# EAGLE design multi_fly (EAGLE 5.11)

## Sheet 1 of 3
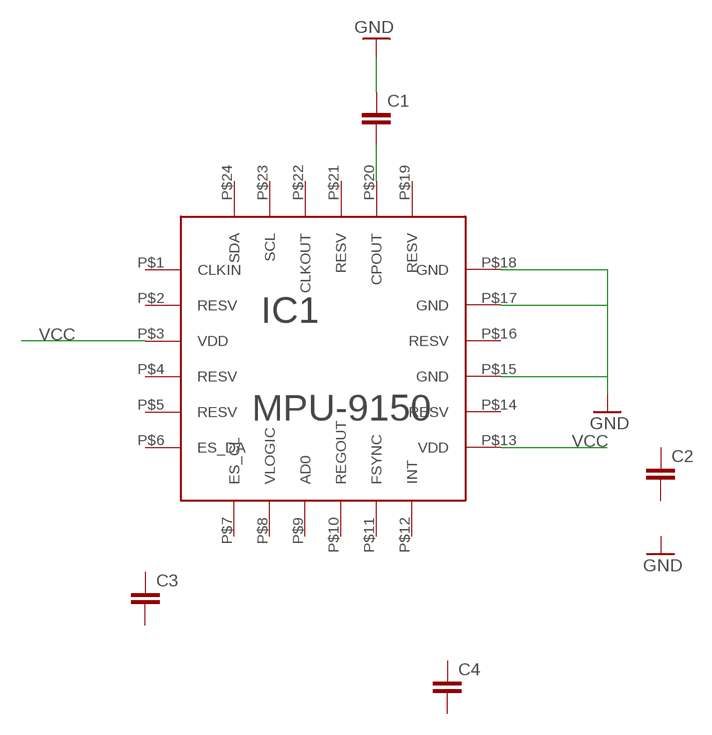
[diagram p0: schematic, sheet 1]

### Parts
C1  CAP0603-CAP  [0603-CAP]
C2  CAP0603-CAP  [0603-CAP]
C3  CAP0603-CAP  [0603-CAP]
C4  CAP0603-CAP  [0603-CAP]
IC1  MPU-9150  [MPU-9150]

### Nets
GND: C1.1 IC1.P$15(GND) IC1.P$17(GND) IC1.P$18(GND) ; also sheet 2,3
N$1: C1.2 IC1.P$20(CPOUT)
VCC: IC1.P$3(VDD) IC1.P$13(VDD) ; also sheet 2,3
Unconnected: C2.1 C2.2 C3.1 C3.2 C4.1 C4.2 IC1.P$1(CLKIN) IC1.P$2(RESV) IC1.P$4(RESV) IC1.P$5(RESV) IC1.P$6(ES_DA) IC1.P$7(ES_CL) IC1.P$8(VLOGIC) IC1.P$9(AD0) IC1.P$10(REGOUT) IC1.P$11(FSYNC) IC1.P$12(INT) IC1.P$14(RESV) IC1.P$16(RESV) IC1.P$19(RESV) IC1.P$21(RESV) IC1.P$22(CLKOUT) IC1.P$23(SCL) IC1.P$24(SDA)

## Sheet 2 of 3
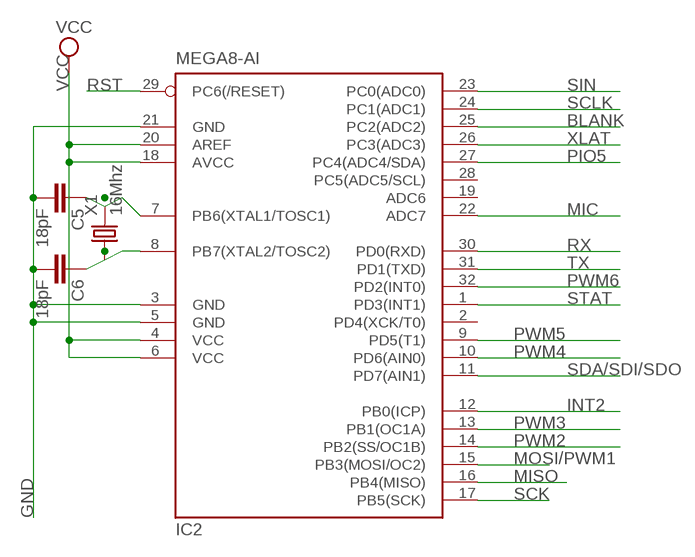
[diagram p1: schematic, sheet 2]

### Parts
C5  18pF  CAP0603-CAP  [0603-CAP]
C6  18pF  CAP0603-CAP  [0603-CAP]
IC2  MEGA8-AI  [TQFP32-08]
X1  16Mhz  CRYSTAL-5032  [5032]

### Nets
BLANK: IC2.25(PC2(ADC2))
GND: C5.2 C6.2 IC2.3(GND) IC2.5(GND) IC2.21(GND) ; also sheet 1,3
INT2: IC2.12(PB0(ICP))
MIC: IC2.22(ADC7)
MISO: IC2.16(PB4(MISO))
MOSI/PWM1: IC2.15(PB3(MOSI/OC2)) ; also sheet 3
N$7: C5.1 IC2.7(PB6(XTAL1/TOSC1)) X1.2
N$8: C6.1 IC2.8(PB7(XTAL2/TOSC2)) X1.1
PIO5: IC2.27(PC4(ADC4/SDA))
PWM2: IC2.14(PB2(SS/OC1B)) ; also sheet 3
PWM3: IC2.13(PB1(OC1A)) ; also sheet 3
PWM4: IC2.10(PD6(AIN0)) ; also sheet 3
PWM5: IC2.9(PD5(T1)) ; also sheet 3
PWM6: IC2.32(PD2(INT0)) ; also sheet 3
RST: IC2.29(PC6(/RESET))
RX: IC2.30(PD0(RXD))
SCK: IC2.17(PB5(SCK))
SCLK: IC2.24(PC1(ADC1))
SDA/SDI/SDO: IC2.11(PD7(AIN1))
SIN: IC2.23(PC0(ADC0))
STAT: IC2.1(PD3(INT1))
TX: IC2.31(PD1(TXD))
VCC: IC2.4(VCC) IC2.6(VCC) IC2.18(AVCC) IC2.20(AREF) ; also sheet 1,3
XLAT: IC2.26(PC3(ADC3))
Unconnected: IC2.2(PD4(XCK/T0)) IC2.19(ADC6) IC2.28(PC5(ADC5/SCL))

## Sheet 3 of 3
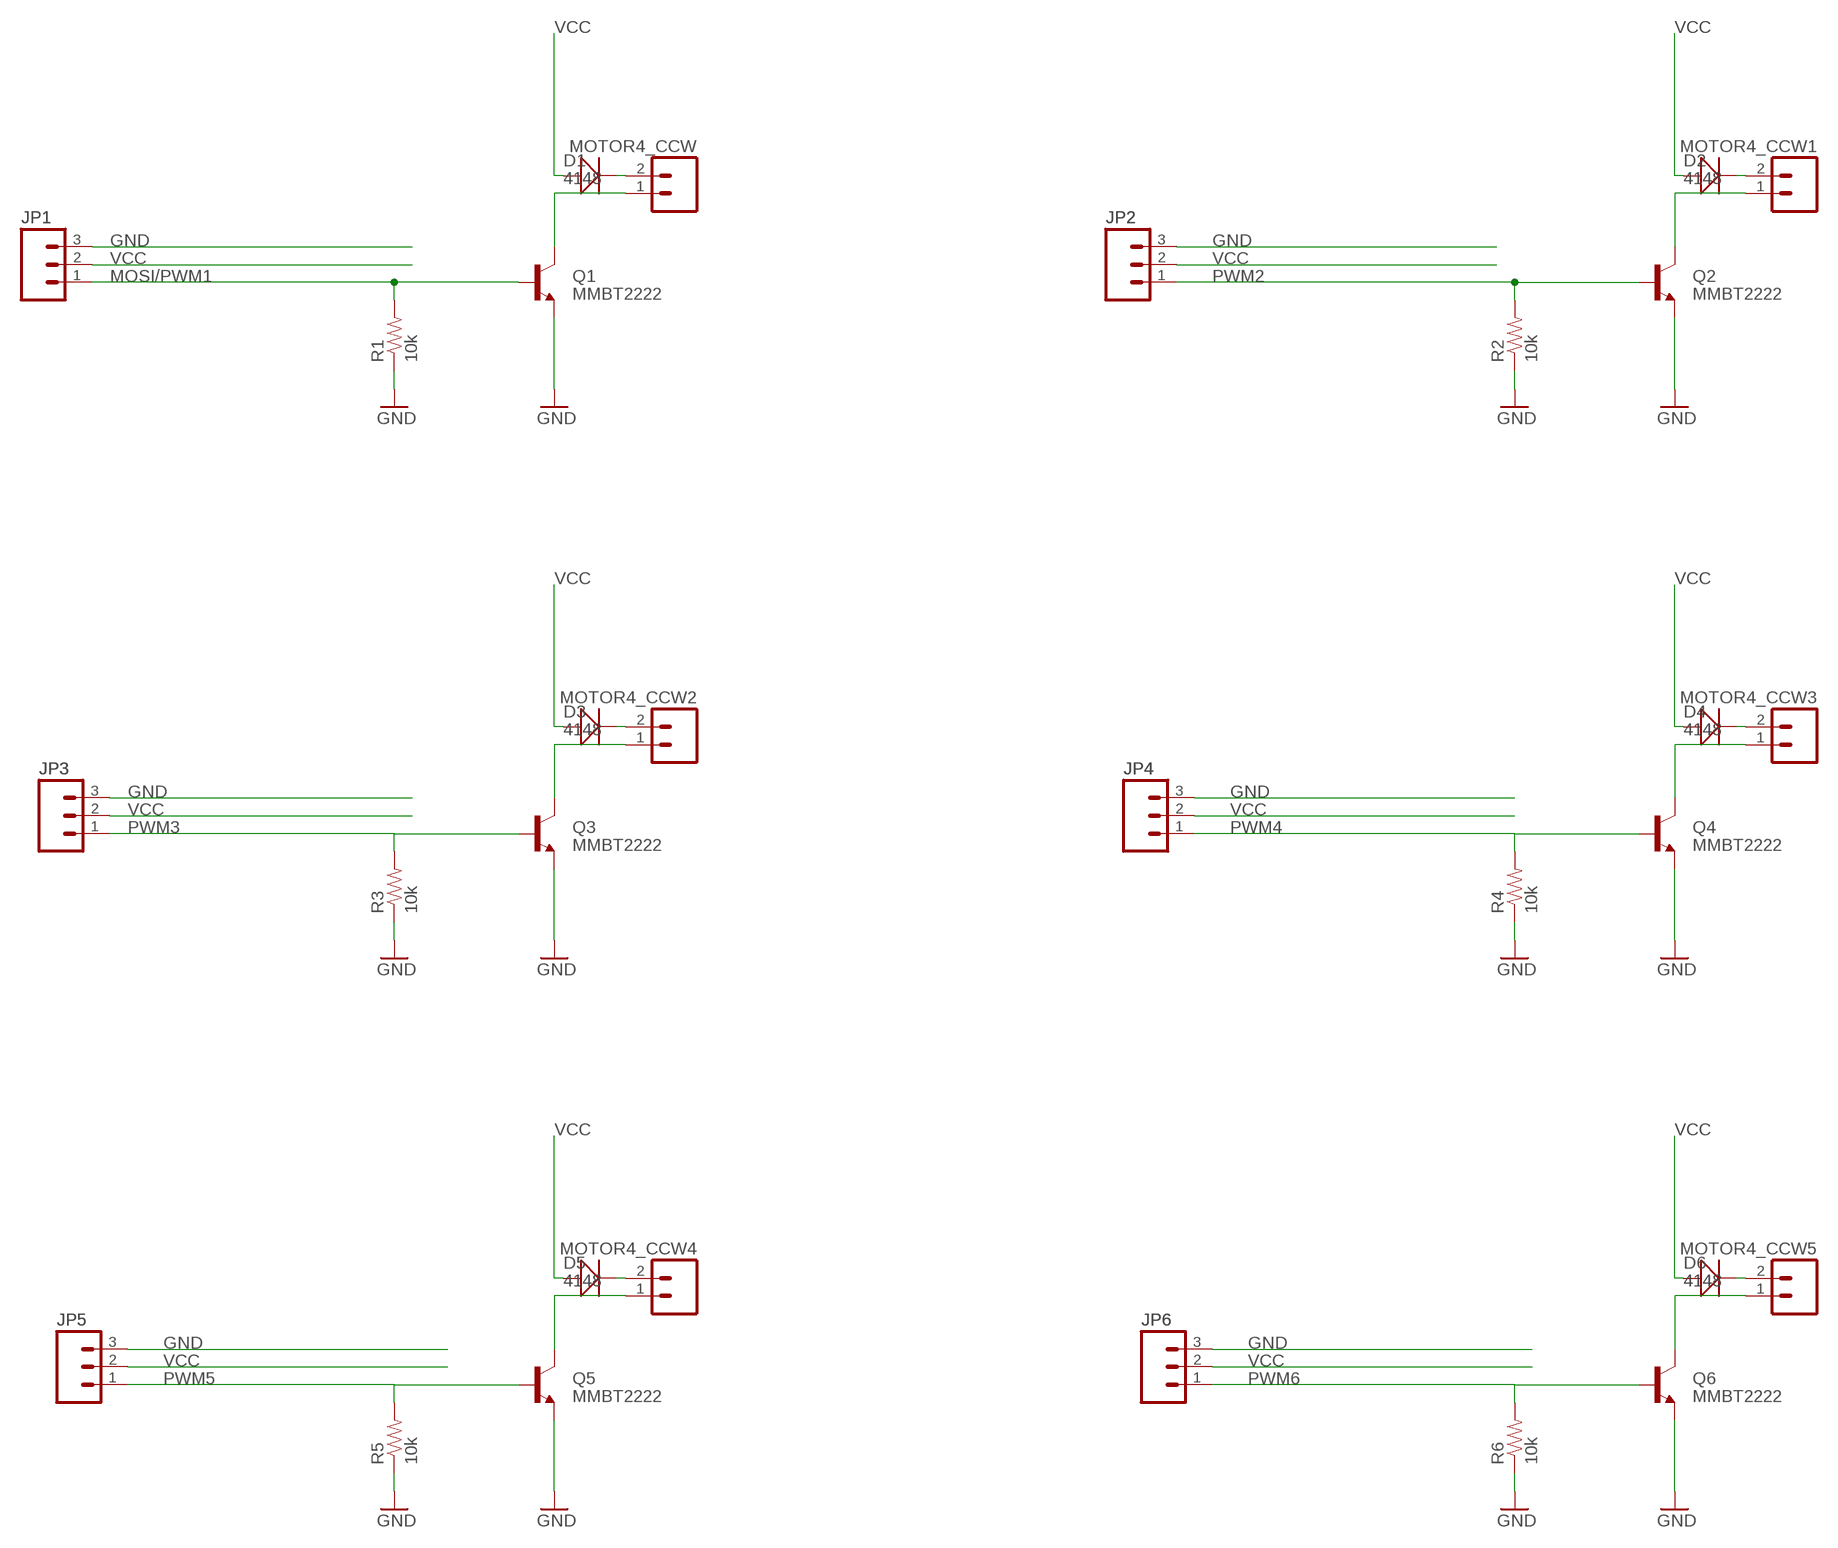
[diagram p2: schematic, sheet 3]

### Parts
D1  4148  D-SOD123  [SOD123]
D2  4148  D-SOD123  [SOD123]
D3  4148  D-SOD123  [SOD123]
D4  4148  D-SOD123  [SOD123]
D5  4148  D-SOD123  [SOD123]
D6  4148  D-SOD123  [SOD123]
JP1  M03PTH  [1X03]
JP2  M03PTH  [1X03]
JP3  M03PTH  [1X03]
JP4  M03PTH  [1X03]
JP5  M03PTH  [1X03]
JP6  M03PTH  [1X03]
MOTOR4_CCW  M021MM_MOTOR  [1MM_MOTOR]
MOTOR4_CCW1  M021MM_MOTOR  [1MM_MOTOR]
MOTOR4_CCW2  M021MM_MOTOR  [1MM_MOTOR]
MOTOR4_CCW3  M021MM_MOTOR  [1MM_MOTOR]
MOTOR4_CCW4  M021MM_MOTOR  [1MM_MOTOR]
MOTOR4_CCW5  M021MM_MOTOR  [1MM_MOTOR]
Q1  MMBT2222  TRANSISTOR_NPNSOT23  [SOT23]
Q2  MMBT2222  TRANSISTOR_NPNSOT23  [SOT23]
Q3  MMBT2222  TRANSISTOR_NPNSOT23  [SOT23]
Q4  MMBT2222  TRANSISTOR_NPNSOT23  [SOT23]
Q5  MMBT2222  TRANSISTOR_NPNSOT23  [SOT23]
Q6  MMBT2222  TRANSISTOR_NPNSOT23  [SOT23]
R1  10k  RESISTOR  [0805]
R2  10k  RESISTOR  [0805]
R3  10k  RESISTOR  [0805]
R4  10k  RESISTOR  [0805]
R5  10k  RESISTOR  [0805]
R6  10k  RESISTOR  [0805]

### Nets
GND: JP1.3 JP2.3 JP3.3 JP4.3 JP5.3 JP6.3 Q1.2(E) Q2.2(E) Q3.2(E) Q4.2(E) Q5.2(E) Q6.2(E) R1.1 R2.1 R3.1 R4.1 R5.1 R6.1 ; also sheet 1,2
MOSI/PWM1: JP1.1 Q1.1(B) R1.2 ; also sheet 2
N$2: D2.- MOTOR4_CCW1.2
N$3: MOTOR4_CCW1.1 Q2.3(C)
N$4: D3.- MOTOR4_CCW2.2
N$5: MOTOR4_CCW2.1 Q3.3(C)
N$6: D4.- MOTOR4_CCW3.2
N$9: MOTOR4_CCW3.1 Q4.3(C)
N$10: D5.- MOTOR4_CCW4.2
N$11: MOTOR4_CCW4.1 Q5.3(C)
N$12: D6.- MOTOR4_CCW5.2
N$13: MOTOR4_CCW5.1 Q6.3(C)
N$14: D1.- MOTOR4_CCW.2
N$31: MOTOR4_CCW.1 Q1.3(C)
PWM2: JP2.1 Q2.1(B) R2.2 ; also sheet 2
PWM3: JP3.1 Q3.1(B) R3.2 ; also sheet 2
PWM4: JP4.1 Q4.1(B) R4.2 ; also sheet 2
PWM5: JP5.1 Q5.1(B) R5.2 ; also sheet 2
PWM6: JP6.1 Q6.1(B) R6.2 ; also sheet 2
VCC: D1.+ D2.+ D3.+ D4.+ D5.+ D6.+ JP1.2 JP2.2 JP3.2 JP4.2 JP5.2 JP6.2 ; also sheet 1,2

## Library data of the parts
C1-C6 = SparkFun:CAP: Capacitor Standard 0603 ceramic capacitor, and 0.1" leaded capacitor.
D1-D6 = NSL_MiniQuad:D*
IC1 = multi_fly:MPU-9150
IC2 = atmel:MEGA8: MICROCONTROLLER 8 Kbytes FLASH, 1 kbytes SRAM, 512 bytes EEPROM, USART, 6-channel 10 bit ADC, 2-channel 8 bit ADC Pin compatible with Atmega48, ATMega88, ATMega168 Source: avr.lbr; MPN: ATMEGA8-16AU; OC_FARNELL: 9171371; OC_NEWARK: 73M8863
JP1-JP6 = Speaker_shield:M03: Header 3 Standard 3-pin 0.1" header. Use with straight break away headers (SKU : PRT-00116), right angle break away headers (PRT-00553), swiss pins (PRT-00743), machine pins (PRT-00117), and female headers (PRT-00115). Molex polarized connector foot print use with SKU : PRT-08232 with associated crimp pins and housings.
MOTOR4_CCW MOTOR4_CCW1-MOTOR4_CCW5 = NSL_MiniQuad:M02: Header 2 Standard 2-pin 0.1" header. Use with straight break away headers (SKU : PRT-00116), right angle break away headers (PRT-00553), swiss pins (PRT-00743), machine pins (PRT-00117), and female headers (PRT-00115). Molex polarized connector foot print use with SKU : PRT-08233 with associated crimp pins and housings.
Q1-Q6 = SparkFun:TRANSISTOR_NPN: Transistor NPN BJT configuration in SOT23 package. MMBT2222 is the common NPN we use. Double check BCE configuration again layout.
R1-R6 = SparkFun:RESISTOR: Resistor Basic schematic elements and footprints for 0603, 1206, and PTH 1/10th watt (small) resistors.
X1 = NSL_MiniQuad:CRYSTAL*: CRYSTAL

## Board
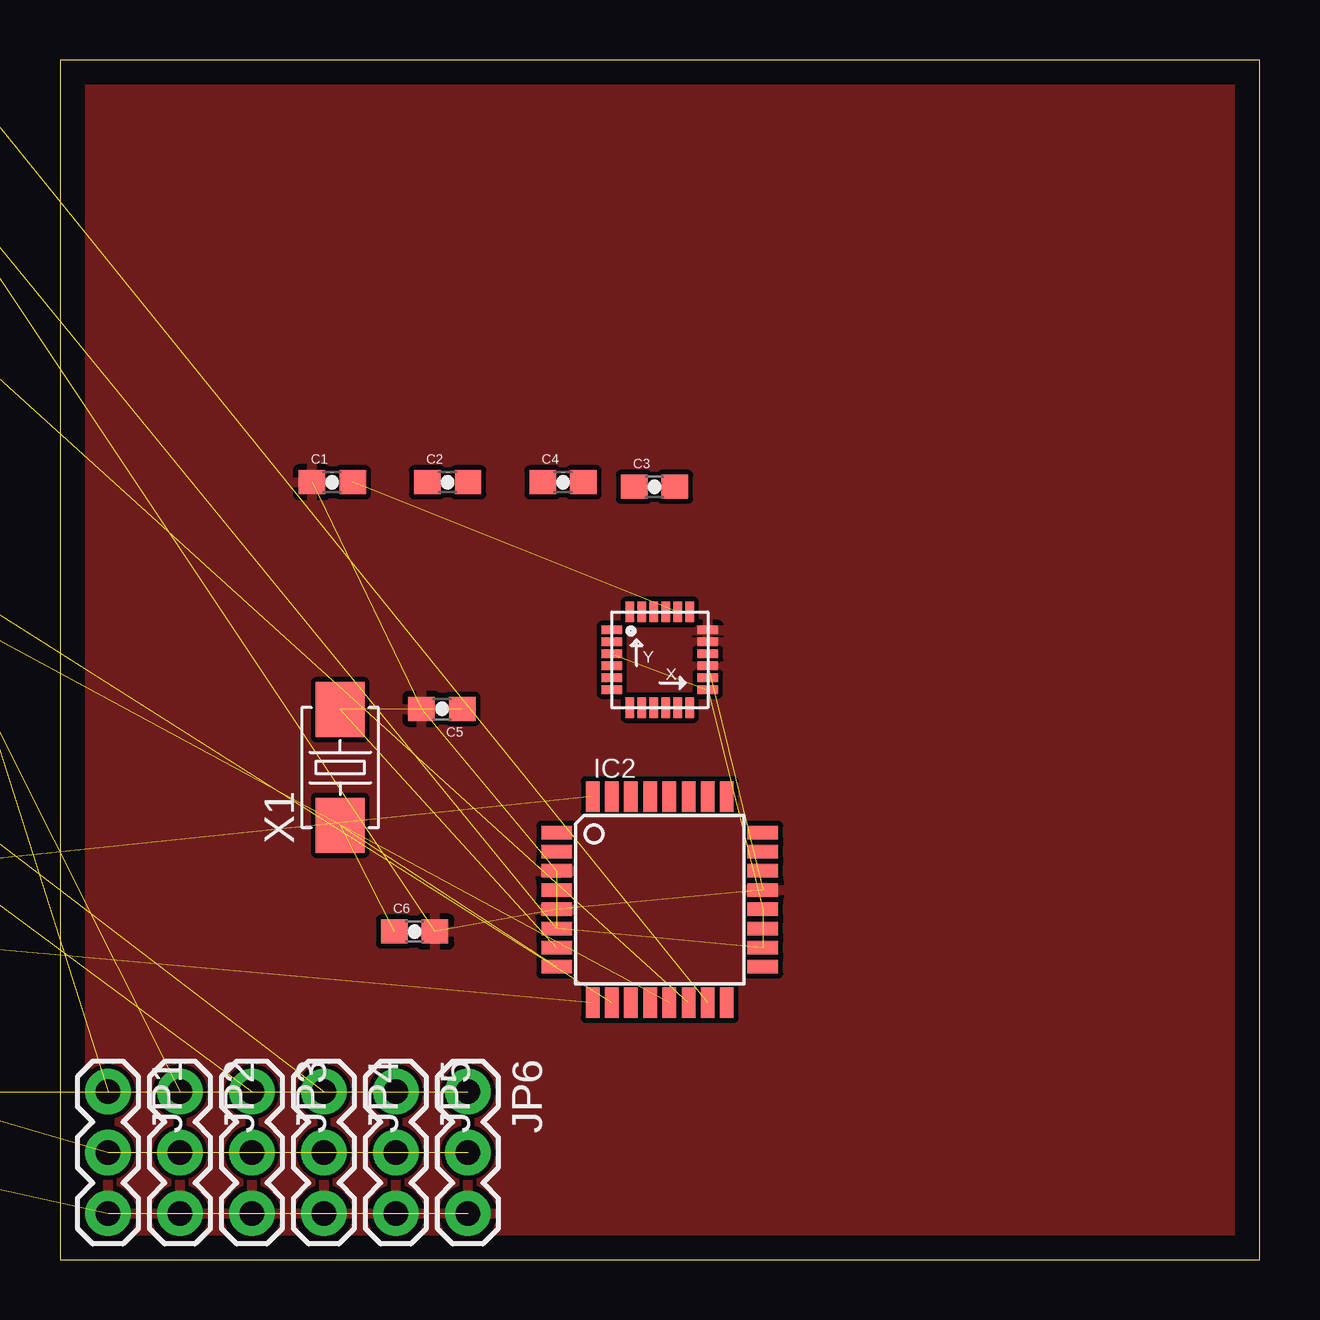
[diagram p3: board, top side]
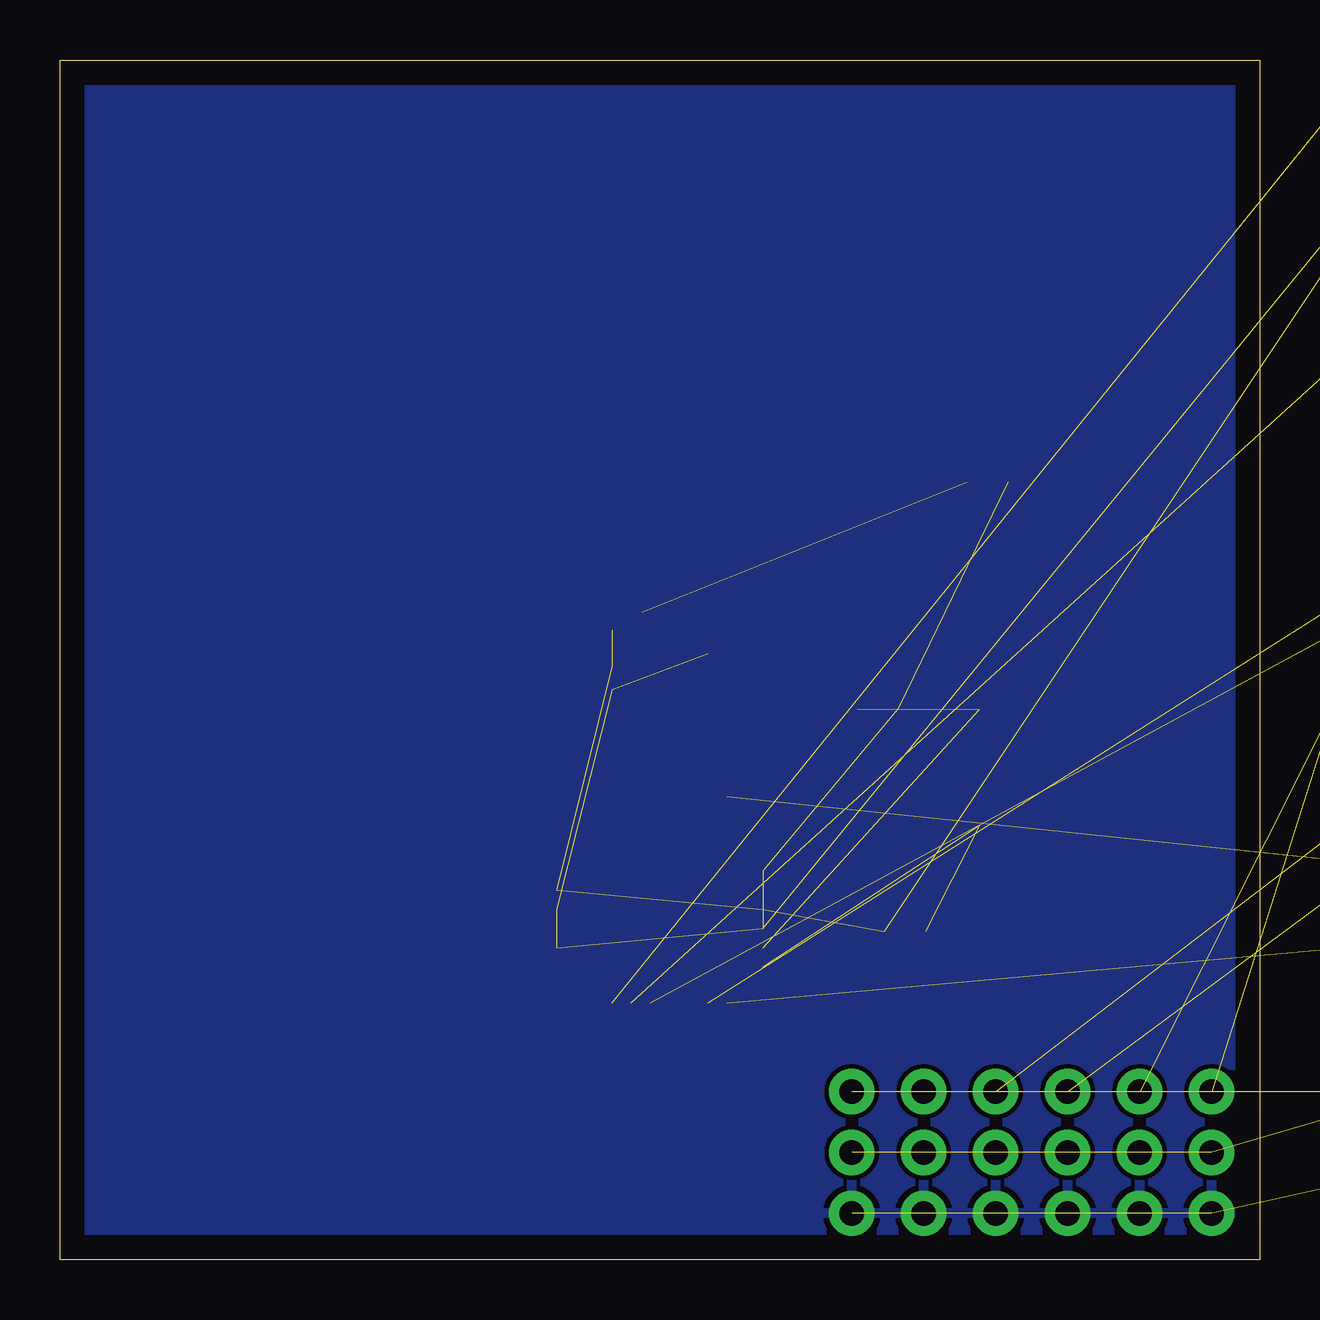
[diagram p4: board, bottom side, seen from below]

Size 50 x 50 mm. Coordinates in mm from the lower left corner, seen from the top.
Outline: 0,0 50,0 50,50 0,50 0,0
Copper layers (1*16): Top 0.035mm / dielectric 1.5mm / Bottom 0.035mm
Design rules "default": minimum track width 10mil, minimum drill 24mil, track to track 8mil, track to pad 8mil, pad to pad 8mil, via to via 8mil, smd to smd 8mil, copper to edge 40mil, drill to drill 8mil, minimum pad ring 10mil, minimum via ring 8mil, stop-mask expansion 4mil, vias tented up to drill 0mil, thermal gap 10mil

### Footprints (pad centres in the part's own frame; a part is rotated, then mirrored left to right if it is on the bottom)
0603-CAP = smd 1.1 x 1: 1 -0.85,0; 2 0.85,0
SOD123 = smd 1.397 x 1.397: + 1.651,0; - -1.651,0
MPU-9150 = smd 0.85 x 0.35: P$1 -2,1.25; P$2 -2,0.75; P$3 -2,0.25; P$4 -2,-0.25; P$5 -2,-0.75; P$6 -2,-1.25; P$13 2,-1.25; P$14 2,-0.75; P$15 2,-0.25; P$16 2,0.25; P$17 2,0.75; P$18 2,1.25 | smd 0.35 x 0.85: P$7 -1.25,-2; P$8 -0.75,-2; P$9 -0.25,-2; P$10 0.25,-2; P$11 0.75,-2; P$12 1.25,-2; P$19 1.25,2; P$20 0.75,2; P$21 0.25,2; P$22 -0.25,2; P$23 -0.75,2; P$24 -1.25,2
TQFP32-08 = smd 1.27 x 0.559: 1 -4.293,2.8; 2 -4.293,2; 3 -4.293,1.2; 4 -4.293,0.4; 5 -4.293,-0.4; 6 -4.293,-1.2; 7 -4.293,-2; 8 -4.293,-2.8; 17 4.293,-2.8; 18 4.293,-2; 19 4.293,-1.2; 20 4.293,-0.4; 21 4.293,0.4; 22 4.293,1.2; 23 4.293,2; 24 4.293,2.8 | smd 0.559 x 1.27: 9 -2.8,-4.293; 10 -2,-4.293; 11 -1.2,-4.293; 12 -0.4,-4.293; 13 0.4,-4.293; 14 1.2,-4.293; 15 2,-4.293; 16 2.8,-4.293; 25 2.8,4.293; 26 2,4.293; 27 1.2,4.293; 28 0.4,4.293; 29 -0.4,4.293; 30 -1.2,4.293; 31 -2,4.293; 32 -2.8,4.293
1X03 = drill 1.016 pad 1.88 round: 1 0,0; 2 2.54,0; 3 5.08,0
1MM_MOTOR = drill 0.457 pad 0.991 square: 1 -0.635,0 | drill 0.457 pad 0.991 round: 2 0.635,0
SOT23 = smd 1 x 1.4: 1 -0.95,-1.1; 2 0.95,-1.1; 3 0,1.1
0805 = smd 0.8 x 1.2: 1 -0.9,0; 2 0.9,0
5032 = smd 2.286 x 2.032: 1 -2.413,0; 2 2.413,0

### Placement (x,y rotation side)
C1  11.35,32.4 0 top
C2  16.16,32.4 0 top
C3  24.78,32.21 0 top
C4  20.97,32.4 0 top
C5  15.92,22.95 180 top
C6  14.78,13.67 0 top
D1  -22,64 0 top  (outside the outline)
D2  -22,49 0 top  (outside the outline)
D3  -22,34 0 top  (outside the outline)
D4  -15,34 0 top  (outside the outline)
D5  -22,11 0 top  (outside the outline)
D6  -15,11 0 top  (outside the outline)
IC1  25,25 0 top
IC2  25,15 0 top
JP1  2,7 270 top
JP2  5,7 270 top
JP3  8,7 270 top
JP4  11,7 270 top
JP5  14,7 270 top
JP6  17,7 270 top
MOTOR4_CCW  -18,59 0 top  (outside the outline)
MOTOR4_CCW1  -18,44 0 top  (outside the outline)
MOTOR4_CCW2  -18,25 0 top  (outside the outline)
MOTOR4_CCW3  -23,21 0 top  (outside the outline)
MOTOR4_CCW4  -18,2 0 top  (outside the outline)
MOTOR4_CCW5  -23,-2 0 top  (outside the outline)
Q1  -11,50 0 top  (outside the outline)
Q2  -24,54 0 top  (outside the outline)
Q3  -24,39 0 top  (outside the outline)
Q4  -19,39 0 top  (outside the outline)
Q5  -24,16 0 top  (outside the outline)
Q6  -19,16 0 top  (outside the outline)
R1  -17,64 0 top  (outside the outline)
R2  -17,49 0 top  (outside the outline)
R3  -24,30 0 top  (outside the outline)
R4  -20,30 0 top  (outside the outline)
R5  -24,7 0 top  (outside the outline)
R6  -20,7 0 top  (outside the outline)
X1  11.68,20.51 90 top

### Tracks (layer width: path | path; a pad name or v marks a point on that pad's centre or on a via)
GND  (26 unrouted)
  pour Bottom: -1,51 51,51 51,-1 -1,-1
  pour Top: -2,51 52,51 52,-1 -2,-1
MOSI/PWM1  (3 unrouted)
N$1  (1 unrouted)
N$2  (1 unrouted)
N$3  (1 unrouted)
N$4  (1 unrouted)
N$5  (1 unrouted)
N$6  (1 unrouted)
N$7  (2 unrouted)
N$8  (2 unrouted)
N$9  (1 unrouted)
N$10  (1 unrouted)
N$11  (1 unrouted)
N$12  (1 unrouted)
N$13  (1 unrouted)
N$14  (1 unrouted)
N$31  (1 unrouted)
PWM2  (3 unrouted)
PWM3  (3 unrouted)
PWM4  (3 unrouted)
PWM5  (3 unrouted)
PWM6  (3 unrouted)
VCC  (17 unrouted)